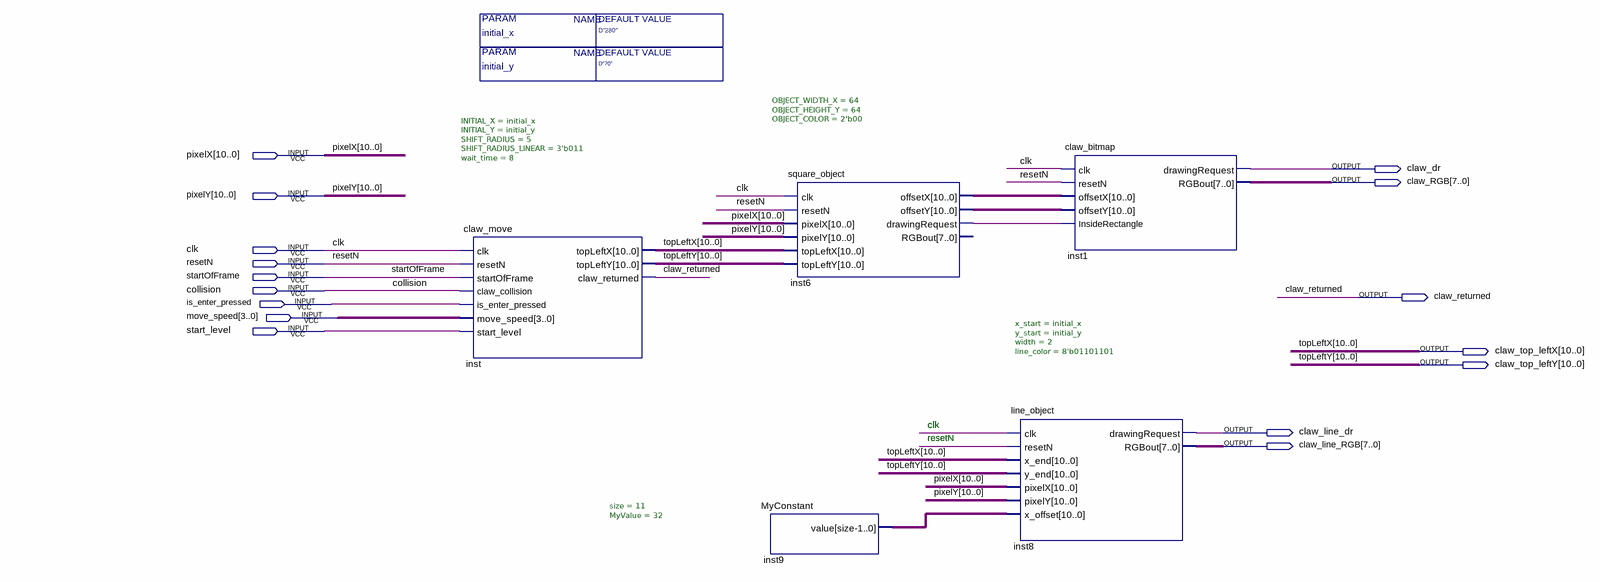
[diagram p0: schematic sheet]
// Quartus schematic Claw_Block_Top.bdf as structural Verilog: 5 symbols, 16 pins
module Claw_Block_Top #(parameter initial_x = "D\"280\"", parameter initial_y = "D\"70\"") (
  input  [10:0] pixelX,
  input  [10:0] pixelY,
  input  clk,
  input  resetN,
  input  startOfFrame,
  input  collision,
  input  is_enter_pressed,
  input  [3:0] move_speed,
  input  start_level,
  output claw_dr,
  output [7:0] claw_RGB,
  output claw_returned,
  output [10:0] claw_top_leftX,
  output [10:0] claw_top_leftY,
  output claw_line_dr,
  output [7:0] claw_line_RGB
);

  wire inst6_drawingrequest;
  wire [10:0] inst6_offsetx, inst6_offsety, inst9_value;

  claw_move #(.INITIAL_X(initial_x), .INITIAL_Y(initial_y), .SHIFT_RADIUS(5), .SHIFT_RADIUS_LINEAR(3'b011), .wait_time(8)) inst (
    .clk(clk), .resetN(resetN), .startOfFrame(startOfFrame), .claw_collision(collision),
    .is_enter_pressed(is_enter_pressed), .move_speed(move_speed), .start_level(start_level),
    .topLeftX(claw_top_leftX), .topLeftY(claw_top_leftY), .claw_returned(claw_returned));
  square_object #(.OBJECT_WIDTH_X(64), .OBJECT_HEIGHT_Y(64), .OBJECT_COLOR(2'b00)) inst6 (
    .clk(clk), .resetN(resetN), .pixelX(pixelX), .pixelY(pixelY), .topLeftX(claw_top_leftX),
    .topLeftY(claw_top_leftY), .offsetX(inst6_offsetx), .offsetY(inst6_offsety),
    .drawingRequest(inst6_drawingrequest));  // open: RGBout
  MyConstant #(.size(11), .MyValue(32)) inst9 (.value(inst9_value));
  line_object #(.x_start(initial_x), .y_start(initial_y), .width(2), .line_color(8'b01101101)) inst8 (
    .clk(clk), .resetN(resetN), .x_end(claw_top_leftX), .y_end(claw_top_leftY), .pixelX(pixelX),
    .pixelY(pixelY), .x_offset(inst9_value), .drawingRequest(claw_line_dr), .RGBout(claw_line_RGB));
  claw_bitmap inst1 (
    .clk(clk), .resetN(resetN), .offsetX(inst6_offsetx), .offsetY(inst6_offsety),
    .InsideRectangle(inst6_drawingrequest), .drawingRequest(claw_dr), .RGBout(claw_RGB));

  // Other names for the same wires on the sheet: topLeftX[10:0] = claw_top_leftX; topLeftY[10:0] = claw_top_leftY

  // Notes on the sheet:
  //   clk
  //   resetN
endmodule
